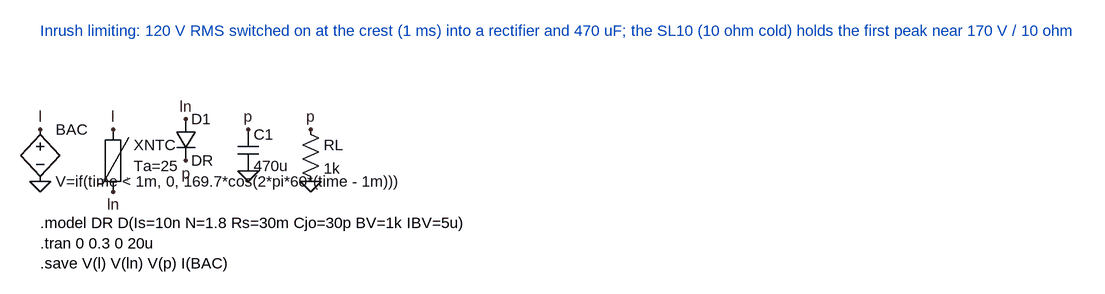
[diagram p0: schematic demo_ntc.asc]
demo_ntc.asc, the LTspice schematic file:
Version 4
SHEET 1 700 400
FLAG 0 112 l
FLAG 0 192 0
FLAG 112 112 l
FLAG 112 208 ln
FLAG 224 96 ln
FLAG 224 160 p
FLAG 320 112 p
FLAG 320 176 0
FLAG 416 112 p
FLAG 416 192 0
SYMBOL bv 0 96 R0
SYMATTR InstName BAC
SYMATTR Value V=if(time < 1m, 0, 169.7*cos(2*pi*60*(time - 1m)))
SYMBOL SL10_10003 96 96 R0
SYMATTR InstName XNTC
SYMBOL diode 208 96 R0
SYMATTR InstName D1
SYMATTR Value DR
SYMBOL cap 304 112 R0
SYMATTR InstName C1
SYMATTR Value 470u
SYMBOL res 400 96 R0
SYMATTR InstName RL
SYMATTR Value 1k
TEXT 0 256 Left 2 !.model DR D(Is=10n N=1.8 Rs=30m Cjo=30p BV=1k IBV=5u)\n.tran 0 0.3 0 20u\n.save V(l) V(ln) V(p) I(BAC)
TEXT 0 -40 Left 2 ;Inrush limiting: 120 V RMS switched on at the crest (1 ms) into a rectifier and 470 uF; the SL10 (10 ohm cold) holds the first peak near 170 V / 10 ohm

The netlist it stands for:
* demo_ntc.asc
BAC l 0 V=if(time < 1m, 0, 169.7*cos(2*pi*60*(time - 1m)))
XXNTC l ln SL10_10003 Ta=25  ; pins A B
D1 ln p DR
C1 p 0 470u
RL p 0 1k
.model D D
.lib standard.dio
.model DR D(Is=10n N=1.8 Rs=30m Cjo=30p BV=1k IBV=5u)
.tran 0 0.3 0 20u
.save V(l) V(ln) V(p) I(BAC)
* Inrush limiting: 120 V RMS switched on at the crest (1 ms) into a rectifier and 470 uF; the SL10 (10 ohm cold) holds the first peak near 170 V / 10 ohm
.lib ntc.sub
.backanno
.end